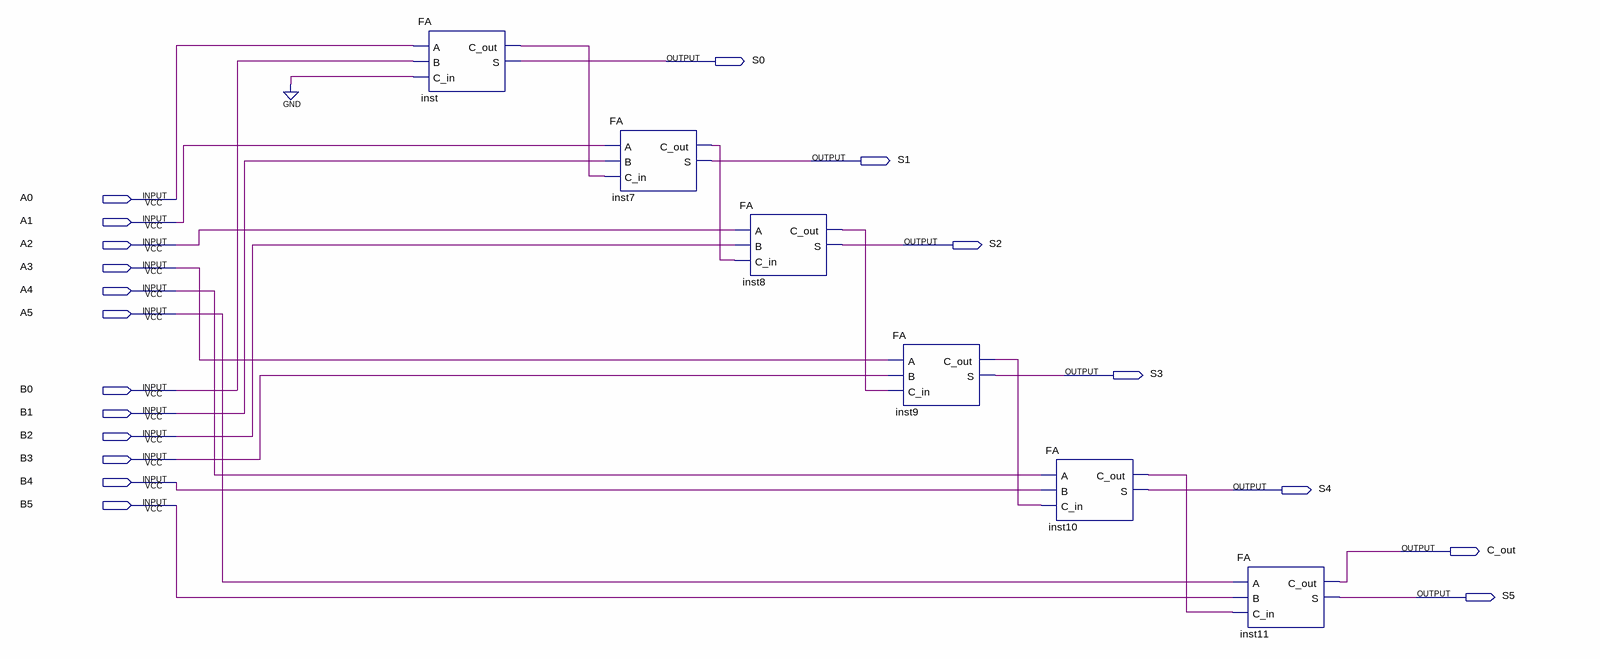
[diagram p0: schematic sheet]
// Quartus schematic 6bit_FA.bdf as structural Verilog: 6 symbols, 19 pins
module \6bit_FA  (
  input  A0,
  input  A1,
  input  A2,
  input  A3,
  input  A4,
  input  A5,
  input  B0,
  input  B1,
  input  B2,
  input  B3,
  input  B4,
  input  B5,
  output S0,
  output S1,
  output S2,
  output S3,
  output S4,
  output C_out,
  output S5
);

  wire inst7_c_out, inst8_c_out, inst9_c_out, inst10_c_out, inst_c_out;

  FA inst (.A(A0), .B(B0), .C_in(1'b0), .C_out(inst_c_out), .S(S0));
  FA inst7 (.A(A1), .B(B1), .C_in(inst_c_out), .C_out(inst7_c_out), .S(S1));
  FA inst8 (.A(A2), .B(B2), .C_in(inst7_c_out), .C_out(inst8_c_out), .S(S2));
  FA inst9 (.A(A3), .B(B3), .C_in(inst8_c_out), .C_out(inst9_c_out), .S(S3));
  FA inst10 (.A(A4), .B(B4), .C_in(inst9_c_out), .C_out(inst10_c_out), .S(S4));
  FA inst11 (.A(A5), .B(B5), .C_in(inst10_c_out), .C_out(C_out), .S(S5));
endmodule
